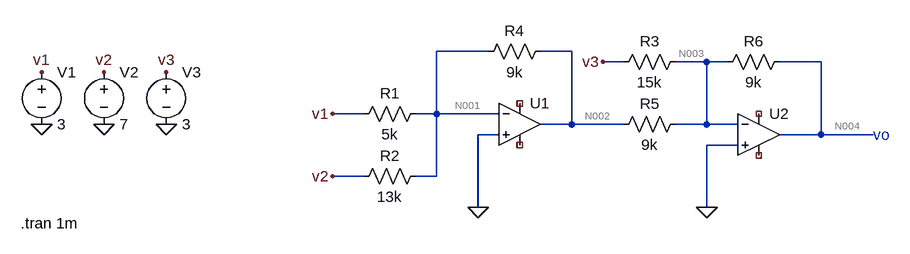
[diagram p0: schematic Q1 at3.asc]
Q1 at3.asc, the LTspice schematic file:
Version 4.1
SHEET 1 880 680
WIRE 176 16 96 16
WIRE 304 16 256 16
WIRE 384 32 352 32
WIRE 512 32 464 32
WIRE 544 32 512 32
WIRE 688 32 624 32
WIRE -16 112 -64 112
WIRE 96 112 96 16
WIRE 96 112 64 112
WIRE 192 112 96 112
WIRE 304 128 304 16
WIRE 304 128 256 128
WIRE 384 128 304 128
WIRE 512 128 512 32
WIRE 512 128 464 128
WIRE 560 128 512 128
WIRE 192 144 160 144
WIRE 688 144 688 32
WIRE 688 144 624 144
WIRE 768 144 688 144
WIRE 560 160 512 160
WIRE -16 208 -64 208
WIRE 96 208 96 112
WIRE 96 208 64 208
WIRE 160 256 160 144
WIRE 512 256 512 160
FLAG -320 128 0
FLAG -416 128 0
FLAG -512 128 0
FLAG -512 48 v1
FLAG -64 112 v1
FLAG -416 48 v2
FLAG -64 208 v2
FLAG -320 48 v3
FLAG 352 32 v3
FLAG 160 256 0
FLAG 512 256 0
SYMBOL res 80 96 R90
WINDOW 0 0 56 VBottom 2
WINDOW 3 32 56 VTop 2
SYMATTR InstName R1
SYMATTR Value 5k
SYMBOL res 80 192 R90
WINDOW 0 0 56 VBottom 2
WINDOW 3 32 56 VTop 2
SYMATTR InstName R2
SYMATTR Value 13k
SYMBOL res 480 16 R90
WINDOW 0 0 56 VBottom 2
WINDOW 3 32 56 VTop 2
SYMATTR InstName R3
SYMATTR Value 15k
SYMBOL res 272 0 R90
WINDOW 0 0 56 VBottom 2
WINDOW 3 32 56 VTop 2
SYMATTR InstName R4
SYMATTR Value 9k
SYMBOL res 480 112 R90
WINDOW 0 0 56 VBottom 2
WINDOW 3 32 56 VTop 2
SYMATTR InstName R5
SYMATTR Value 9k
SYMBOL res 640 16 R90
WINDOW 0 0 56 VBottom 2
WINDOW 3 32 56 VTop 2
SYMATTR InstName R6
SYMATTR Value 9k
SYMBOL OpAmps\\UniversalOpAmp1 224 128 R0
SYMATTR InstName U1
SYMBOL OpAmps\\UniversalOpAmp1 592 144 R0
SYMATTR InstName U2
SYMBOL voltage -512 32 R0
WINDOW 123 0 0 Left 0
WINDOW 39 0 0 Left 0
SYMATTR InstName V1
SYMATTR Value 3
SYMBOL voltage -416 32 R0
WINDOW 123 0 0 Left 0
WINDOW 39 0 0 Left 0
SYMATTR InstName V2
SYMATTR Value 7
SYMBOL voltage -320 32 R0
WINDOW 123 0 0 Left 0
WINDOW 39 0 0 Left 0
SYMATTR InstName V3
SYMATTR Value 3
TEXT 768 144 Left 2 ;vo
TEXT -544 280 Left 2 !.tran 1m

The netlist it stands for:
* Q1 at3.asc
R1 N001 v1 5k
R2 N001 v2 13k
R3 N003 v3 15k
R4 N002 N001 9k
R5 N003 N002 9k
R6 N004 N003 9k
X§U1 0 N001 NC_01 NC_02 N002 level1 Avol=1Meg GBW=10Meg Vos=0 En=0 Enk=0 In=0 Ink=0 Rin=500Meg  ; pins In+ In- V+ V- OUT
X§U2 0 N003 NC_03 NC_04 N004 level1 Avol=1Meg GBW=10Meg Vos=0 En=0 Enk=0 In=0 Ink=0 Rin=500Meg  ; pins In+ In- V+ V- OUT
V1 v1 0 3
V2 v2 0 7
V3 v3 0 3
* vo
.tran 1m
.lib UniversalOpAmp1.lib
.backanno
.end

* Results of the author's LTspice run, read from the files saved beside the schematic
* Operating Point, zero values left out:
*   V(n001) = 10.25 µV
*   V(n002) = -10.25 V
*   V(n003) = -8.446 µV
*   V(n004) = 8.446 V
*   V(v1) = 3 V
*   V(v2) = 7 V
*   V(v3) = 3 V
*   I(R1) = -600 µA
*   I(R2) = -538.5 µA
*   I(R3) = -200 µA
*   I(R4) = -1.138 mA
*   I(R5) = 1.138 mA
*   I(R6) = 938.5 µA
*   I(V1) = -600 µA
*   I(V2) = -538.5 µA
*   I(V3) = -200 µA
*   Ix(u1:5) = 2.277 mA
*   Ix(u2:5) = -938.5 µA